# Altium project KSS_4_GPS.PrjPcb
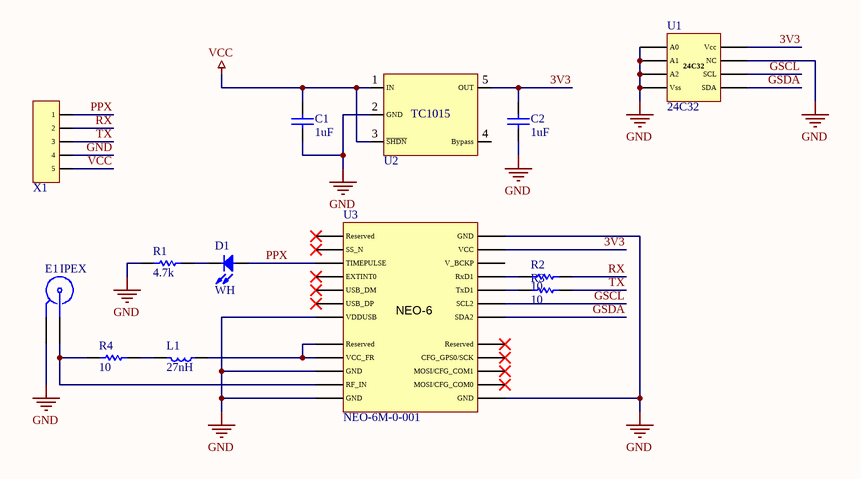
[diagram p0: KSS_4_GPS.SchDoc]
1 sheet, 13 parts. Net scope: global (net labels, ports and power ports of the same name join across sheets).
Board file: KSS_4_GPS.PcbDoc

## Sheet KSS_4_GPS.SchDoc
size A4; SheetNumber: 1; SheetTotal: 1

### Parts
C1  Capacitance: 1uF  [CAP_0805]  (hidden comment: Capacitor)
C2  Capacitance: 1uF  [CAP_0805]  (hidden comment: Capacitor)
D1  WH  [LED_0805]
E1  IPEX  [IPEX]
L1  Inductance: 27nH  [IND_0805]  (hidden comment: Inductor)
R1  Resistance: 4.7k  [RES_0805]  (hidden comment: Resistor)
R2  Resistance: 10  [RES_0805]  (hidden comment: Resistor)
R3  Resistance: 10  [RES_0805]  (hidden comment: Resistor)
R4  Resistance: 10  [RES_0805]  (hidden comment: Resistor)
U1  24C32  [TSSOP-8]
U2  TC1015  [SOT23_5_PIN]  (value not drawn)
U3  NEO-6M-0-001  [NEO-6M-0-001]
X1  HEADER_X5  [HEADER_1X5_M]  (value not drawn)

### Nets
GND: C1.2 C2.2 E1.2 R1.2 U1.1(A0) U1.2(A1) U1.3(A2) U1.4(Vss) U1.7(NC) U2.2(GND) U3.7(VDDUSB) U3.10(GND) U3.12(GND) U3.13(GND) U3.24(GND) X1.4
VCC: C1.1 U2.1(IN) U2.3(~{SHDN}) X1.5
3V3: C2.1 U1.8(Vcc) U2.5(OUT) U3.23(VCC)
GSCL: U1.6(SCL) U3.19(SCL2)
GSDA: U1.5(SDA) U3.18(SDA2)
PPX: D1.1(A) U3.3(TIMEPULSE) X1.1
RX: R2.1 X1.2
TX: R3.1 X1.3
NetD1_2: D1.2(K) R1.1
NetE1_1: E1.1 R4.2 U3.11(RF_IN)
NetL1_1: L1.1 R4.1
NetL1_2: L1.2 U3.8(Reserved) U3.9(VCC_FR)
NetR2_2: R2.2 U3.21(RxD1)
NetR3_2: R3.2 U3.20(TxD1)

Not connected (* = marked no-connect by the designer): U2 4(Bypass); U3 1(Reserved)* 2(SS_N)* 4(EXTINT0)* 5(USB_DM)* 6(USB_DP)* 14(MOSI/CFG_COM0)* 15(MOSI/CFG_COM1)* 16(CFG_GPS0/SCK)* 17(Reserved)* 22(V_BCKP)

### Notes on the sheet
- (in symbol NEO-6M-0-001) NEO-6

### Library data of the parts
D1 = Diode LED
E1 = Antenna
U1 = 24C32: Smart Serial EEPROM I2C
U3 = NEO-6M-0-001: GPS module